# Altium schematic sheet РЕУН.468172.001_Int.SchDoc: =Name-1str
size 840 x 594 mm; SheetNumber: 3; Вид изделия: Документация; Раздел: Документация; Код документа: Э3; Вид документа: Схема электрическая принципиальная; Класс документа: Конструкторский документ; Создавать изделие в PLM: Yes; DocumentCode: РЕУН.468172.001 Э3 2D; DocumentView: Схема электрическая принципиальная; DocumentClass: Конструкторский документ; ProductView: Документация; Format: А1
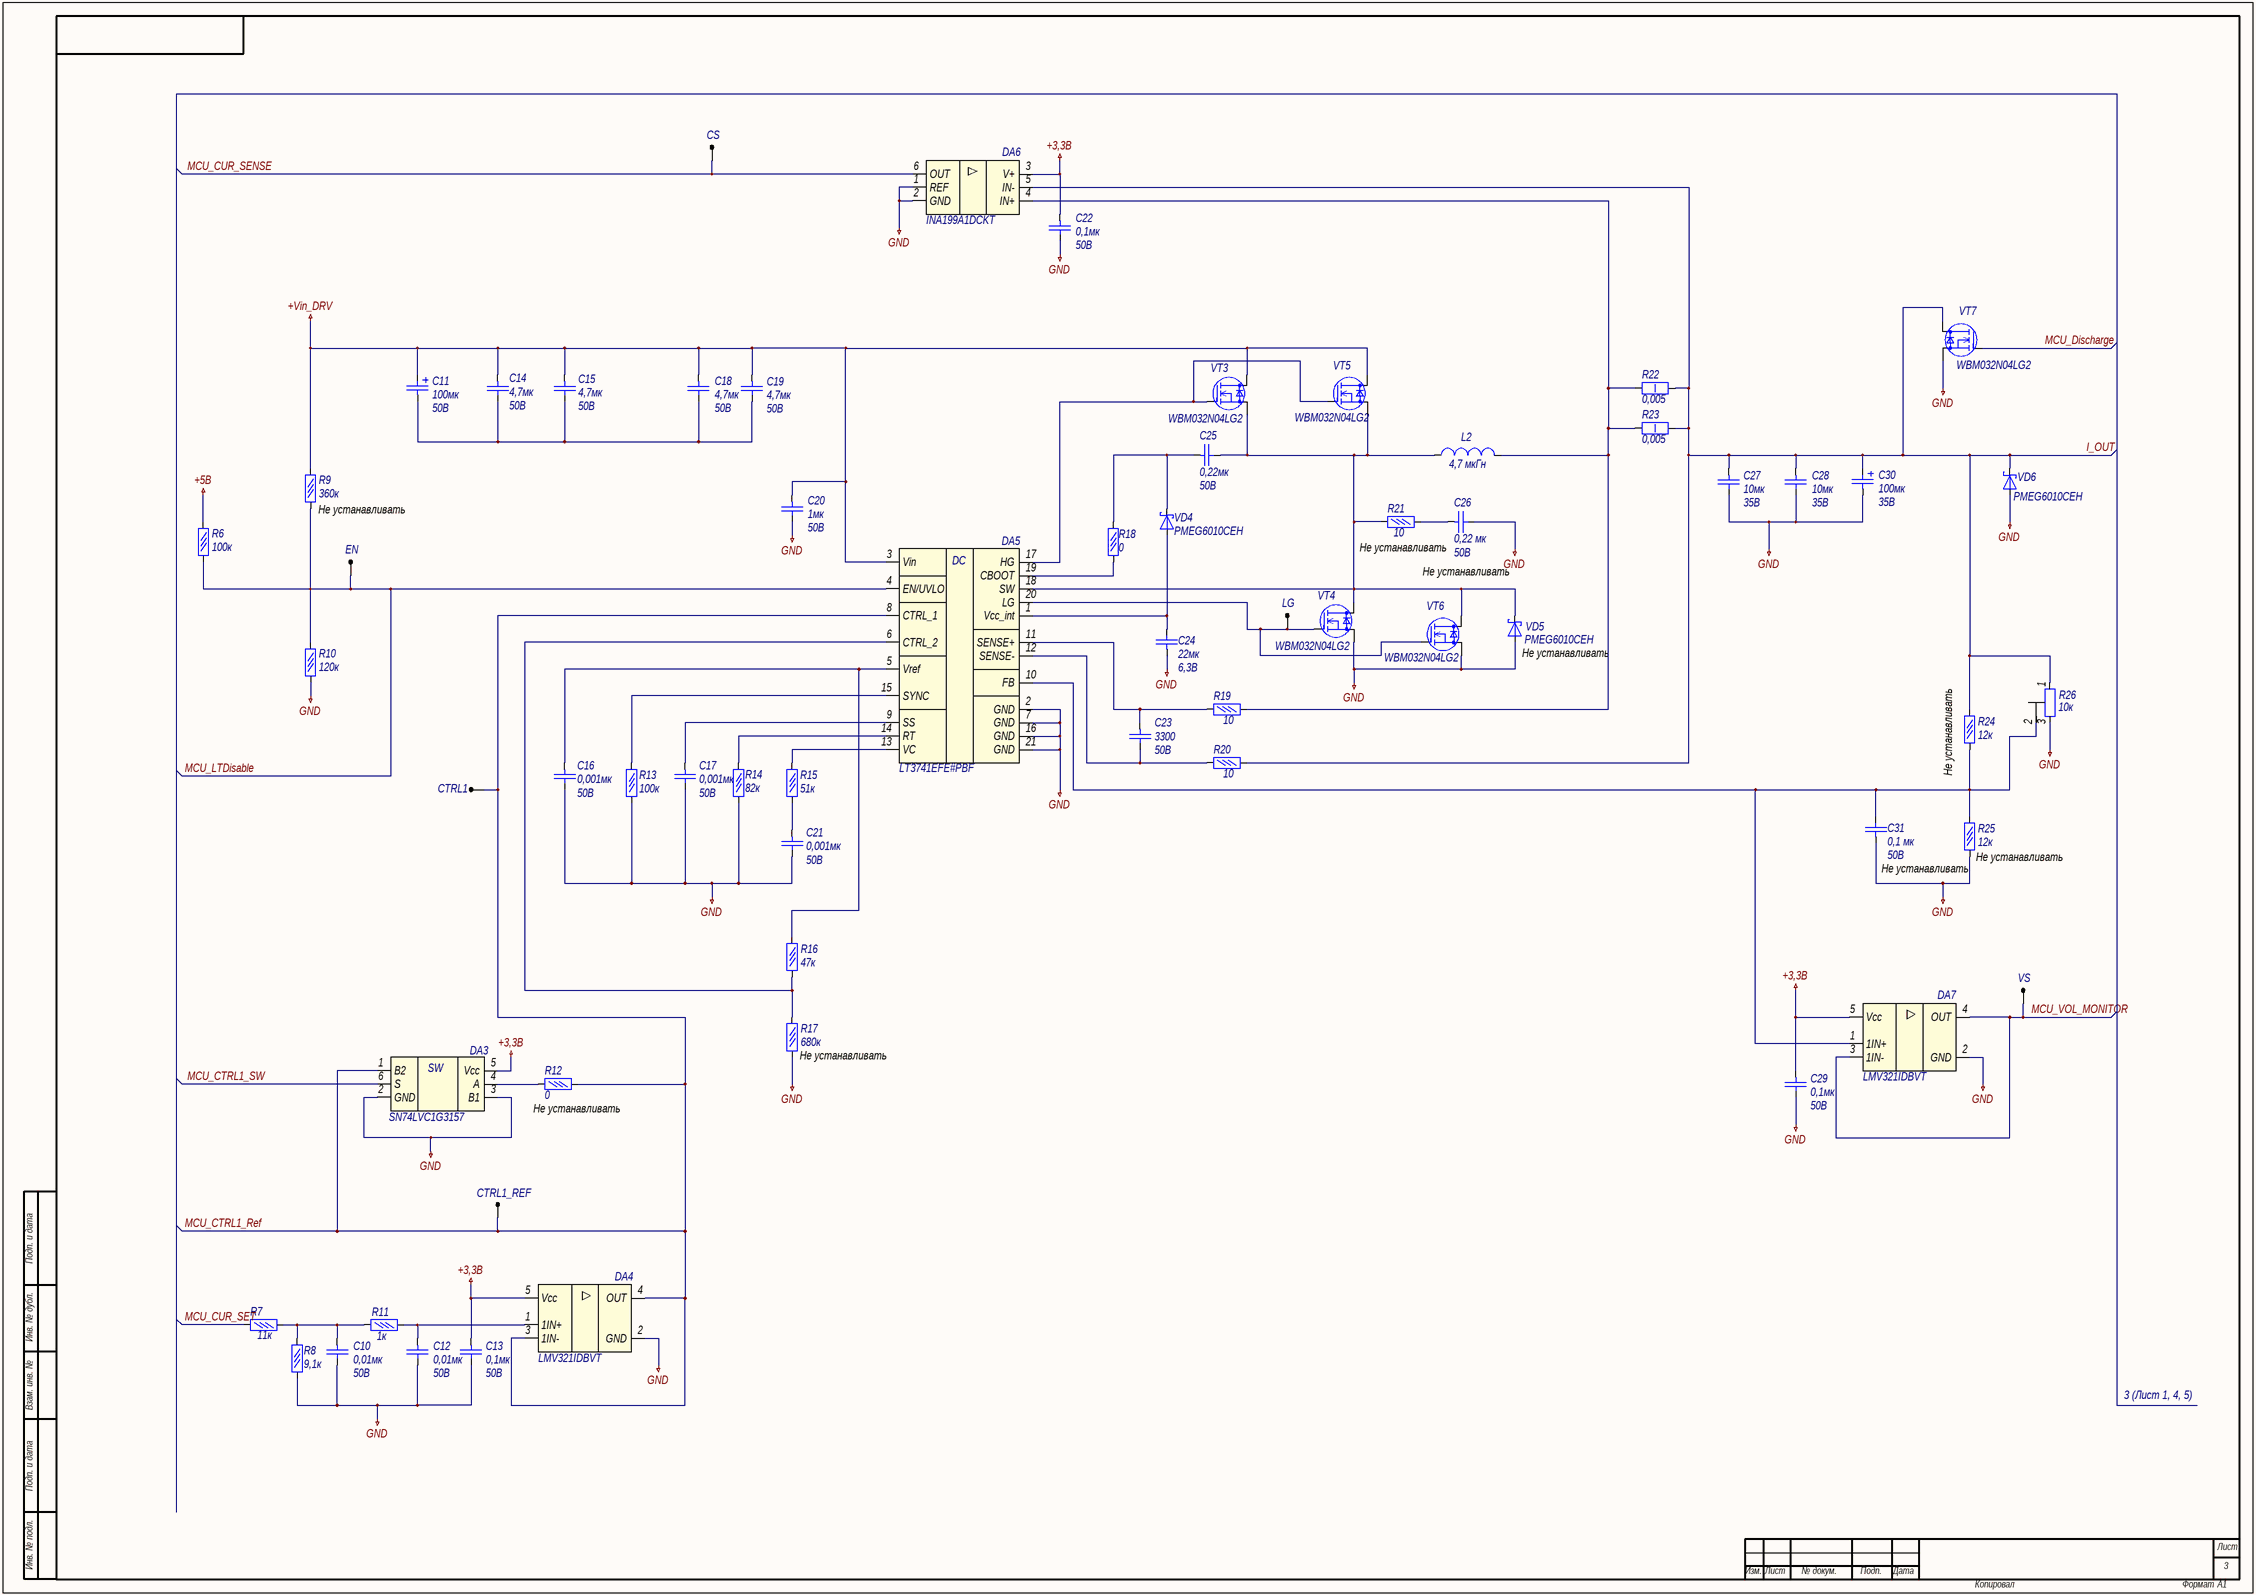
[diagram p0: РЕУН.468172.001_Int.SchDoc]

## Parts
C10  Voltage: 50В  [C0805_AA]  (hidden comment: 0,01мк)
C11  Voltage: 50В  [C0805_AA]  (hidden comment: 100мк)
C12  Voltage: 50В  [C0805_AA]  (hidden comment: 0,01мк)
C13  Voltage: 50В  [C0805_AA]  (hidden comment: 0,1мк)
C14  Voltage: 50В  [C0805_AA]  (hidden comment: 4,7мк)
C15  Voltage: 50В  [C0805_AA]  (hidden comment: 4,7мк)
C16  Voltage: 50В  [C0805_AA]  (hidden comment: 0,001мк)
C17  Voltage: 50В  [C0805_AA]  (hidden comment: 0,001мк)
C18  Voltage: 50В  [C0805_AA]  (hidden comment: 4,7мк)
C19  Voltage: 50В  [C0805_AA]  (hidden comment: 4,7мк)
C20  Voltage: 50В  [C0805_AA]  (hidden comment: 1мк)
C21  Voltage: 50В  [C0805_AA]  (hidden comment: 0,001мк)
C22  Voltage: 50В  [C0805_AA]  (hidden comment: 0,1мк)
C23  Voltage: 50В  [C0805_AA]  (hidden comment: 3300)
C24  Voltage: 6,3В  [C0805_AA]  (hidden comment: 22мк)
C25  Voltage: 50В  [C0805_AA]  (hidden comment: 0,22мк)
C26  Voltage: 50В  [C0805_AA]  (hidden comment: 0,22 мк)
C27  Voltage: 35В  [C0805_AA]  (hidden comment: 10мк)
C28  Voltage: 35В  [C0805_AA]  (hidden comment: 10мк)
C29  Voltage: 50В  [C0805_AA]  (hidden comment: 0,1мк)
C30  Voltage: 35В  [C0805_AA]  (hidden comment: 100мк)
C31  Voltage: 50В  [C0805_AA]  (hidden comment: 0,1 мк)
CS  "1"  [0.5 x 1_round]  (value not drawn)
CTRL1  "1"  [0.5 x 1_round]  (value not drawn)
CTRL1_REF  "1"  [0.5 x 1_round]  (value not drawn)
DA3  SN74LVC1G3157
DA4  LMV321IDBVT
DA5  LT3741EFE#PBF
DA6  INA199A1DCKT
DA7  LMV321IDBVT
EN  "1"  [0.5 x 1_round]  (value not drawn)
L2  4,7 мкГн  [L0603_A]
LG  "1"  [0.5 x 1_round]  (value not drawn)
R6  100к  [R1206]
R7  11к  [R1206]
R8  9,1к  [R1206]
R9  360к  [R1206]
R10  120к  [R1206]
R11  1к  [R1206]
R12  0  [R1206]
R13  100к  [R1206]
R14  82к  [R1206]
R15  51к  [R1206]
R16  47к  [R1206]
R17  680к  [R1206]
R18  0  [R1206]
R19  10  [R1206]
R20  10  [R1206]
R21  10  [R1206]
R22  0,005  [R1206]
R23  0,005  [R1206]
R24  12к  [R1206]
R25  12к  [R1206]
R26  10к
VD4  PMEG6010CEH  [SOD123_A]
VD5  PMEG6010CEH  [SOD123_A]
VD6  PMEG6010CEH  [SOD123_A]
VS  "1"  [0.5 x 1_round]  (value not drawn)
VT3  WBM032N04LG2  [КТ-111В-1.02]
VT4  WBM032N04LG2  [КТ-111В-1.02]
VT5  WBM032N04LG2  [КТ-111В-1.02]
VT6  WBM032N04LG2  [КТ-111В-1.02]
VT7  WBM032N04LG2  [КТ-111В-1.02]

## Nets
+3,3В: C13.2 C22.2 C29.2 DA3.5(Vcc) DA4.5(Vcc) DA6.3(V+) DA7.5(Vcc)
+5В: R6.2
+Vin_DRV: C11.1 C14.2 C15.2 C18.2 C19.2 C20.2 DA5.3(Vin) R9.2 VT3.3(D) VT5.3(D)
GND: C10.1 C12.1 C13.1 C16.1 C17.1 C20.1 C21.1 C22.1 C24.2 C26.1 C27.1 C28.1 C29.1 C30.2 C31.2 DA3.2(GND) DA3.3(B1) DA4.2(GND) DA5.2(GND) DA5.7(GND) DA5.16(GND) DA5.21(GND) DA6.1(REF) DA6.2(GND) DA7.2(GND) R8.1 R10.1 R13.1 R14.1 R17.1 R25.1 R26.3 VD5.2(A) VD6.2(A) VT4.2(S) VT6.2(S) VT7.2(S)
I_OUT: C27.2 C28.2 C30.1 DA6.5(IN-) R20.2 R22.2 R23.2 R24.2 R26.1 VD6.1(K) VT7.3(D)
MCU_CTRL1_Ref: CTRL1.1 CTRL1_REF.1 DA3.1(B2) DA4.3(1IN-) DA4.4(OUT) DA5.8(CTRL_1) R12.1
MCU_CTRL1_SW: DA3.6(S)
MCU_CUR_SENSE: CS.1 DA6.6(OUT)
MCU_CUR_SET: R7.2
MCU_Discharge: VT7.1(G)
MCU_LTDisable: DA5.4(EN/UVLO) EN.1 R6.1 R9.1 R10.2
MCU_VOL_MONITOR: DA7.3(1IN-) DA7.4(OUT) VS.1
NetC10_2: C10.2 R7.1 R8.2 R11.2
NetC11_2: C11.2 C14.1 C15.1 C18.1 C19.1
NetC12_2: C12.2 DA4.1(1IN+) R11.1
NetC16_2: C16.2 DA5.5(Vref) R16.2
NetC17_2: C17.2 DA5.9(SS)
NetC21_2: C21.2 R15.1
NetC23_1: C23.1 DA5.12(SENSE-) R20.1
NetC23_2: C23.2 DA5.11(SENSE+) R19.1
NetC24_1: C24.1 DA5.1(Vcc_int) VD4.2(A)
NetC25_1: C25.1 DA5.18(SW) L2.1 R21.1 VD5.1(K) VT3.2(S) VT4.3(D) VT5.2(S) VT6.3(D)
NetC25_2: C25.2 R18.2 VD4.1(K)
NetC26_2: C26.2 R21.2
NetC31_1: C31.1 DA5.10(FB) DA7.1(1IN+) R24.1 R25.2 R26.2
NetDA3_4: DA3.4(A) R12.2
NetDA5_6: DA5.6(CTRL_2) R16.1 R17.2
NetDA5_13: DA5.13(VC) R15.2
NetDA5_14: DA5.14(RT) R14.2
NetDA5_15: DA5.15(SYNC) R13.2
NetDA5_17: DA5.17(HG) VT3.1(G) VT5.1(G)
NetDA5_19: DA5.19(CBOOT) R18.1
NetDA5_20: DA5.20(LG) LG.1 VT4.1(G) VT6.1(G)
NetDA6_4: DA6.4(IN+) L2.2 R19.2 R22.1 R23.1

## Notes on the sheet
- (near R9) Не устанавливать
- Не устанавливать
- (near VD5) Не устанавливать
- (near R24) Не устанавливать
- (near R25) Не устанавливать
- (near R17) Не устанавливать
- (near R12) Не устанавливать
- 3 (Лист 1, 4, 5)
- Подп. и дата
- Инв. № дубл.
- Взам. инв. №
- Инв. № подл.
- Лист
- Изм.
- № докум.
- Подп.
- Дата
- Копировал
- Формат
- (in symbol LT3741) DC
- (in symbol SN74LVC1G3157) SW

## Library data of the parts
C10 C12 C13 C22 C29 = Конденсатор кер.: Name: CC0603KRX7R9BB104
  C10 C12: Value: 0,01мк
  C13 C22 C29: Value: 0,1мк
C11 = Конденсатор поляризованный: Конденсатор пол.; Name: EEHZC1H101P; Value: 100мк
C14 C15 C18 C19 = Конденсатор кер.: Name: C1210C475K5RACTU; Value: 4,7мк
C16 = Конденсатор кер.: Name: CC0603KRX7R9BB102; Value: 0,001мк
C17 C21 = Конденсатор кер.: Name: CC0603KRX7R9BB103; Value: 0,001мк
C20 = Конденсатор кер.: Name: 08055D105KAT2A; Value: 1мк
C23 = Конденсатор кер.: Name: CC0603KRX7R9BB333; Value: 3300
C24-C26 C31 = Конденсатор кер.: Name: CC0603ZRY5V9BB224
  C24: Value: 22мк
  C25: Value: 0,22мк
  C26: Value: 0,22 мк
  C31: Value: 0,1 мк
C27 C28 = Конденсатор кер.: Name: C1210C476M4PACTU; Value: 10мк
C30 = Конденсатор поляризованный: Конденсатор пол.; Name: EEE-FP1A221AP; Value: 100мк
CS CTRL1 CTRL1_REF EN LG VS = TestPoint: Test point; Comment_1: "1"
DA3 = SN74LVC1G3157: Аналоговый переключатель, двухпозиционный
DA4 DA7 = LMV321: Операционный усилитель Rail-to-rail
DA5 = LT3741: Step-Down Controller, Constant Voltage
DA6 = INA199: Voltage output current shunt monitor
L2 = Inductor: Катушка индуктивности; Name: 7443551130; Value: 4,7 мкГн
R6 R9 = Резистор  0,05Вт: Резистор 0,05Вт; Name: RC0603FR-07360KL; Power rating: 0,05Вт
  R6: Value: 100к
  R9: Value: 360к
R7 = Резистор  0,05Вт: Резистор 0,05Вт; Name: RC0603FR-0711KL; Power rating: 0,05Вт; Value: 11к
R8 = Резистор  0,05Вт: Резистор 0,05Вт; Name: 'RC0603FR-079K1L; Power rating: 0,05Вт; Value: 9,1к
R10 = Резистор  0,05Вт: Резистор 0,05Вт; Name: RC0603FR-07120KL; Power rating: 0,05Вт; Value: 120к
R11 = Резистор  0,05Вт: Резистор 0,05Вт; Name: RC0603FR-0710KL; Power rating: 0,05Вт; Value: 1к
R12 R17-R20 = Резистор  0,05Вт: Резистор 0,05Вт; Name: RC0603FR-07680KL; Power rating: 0,05Вт
  R12 R18: Value: 0
  R17: Value: 680к
  R19 R20: Value: 10
R13 R14 = Резистор  0,05Вт: Резистор 0,05Вт; Name: RC0603FR-07100KL; Power rating: 0,05Вт
  R13: Value: 100к
  R14: Value: 82к
R15 R24 R25 = Резистор  0,05Вт: Резистор 0,05Вт; Name: RT0603DRD0765K5L; Power rating: 0,05Вт
  R15: Value: 51к
  R24 R25: Value: 12к
R16 = Резистор  0,05Вт: Резистор 0,05Вт; Name: RC0603FR-0745K3L; Power rating: 0,05Вт; Value: 47к
R21 = Резистор  0,05Вт: Резистор 0,05Вт; Name: RC0603FR-0710RL; Power rating: 0,05Вт; Value: 10
R22 R23 = Резистор  1Вт: Name: CRCW2512100KFKEG; Power rating: 1Вт; Value: 0,005
R26 = Potentiometer
VD4-VD6 = DiodeSchottky: Диод Шоттки; Name: PMEG6010CEH
VT3-VT7 = N-Mosfet: N-канальный транзистор; Vgs: *; Rds: *; Vds: *; Name: WBM032N04LG2